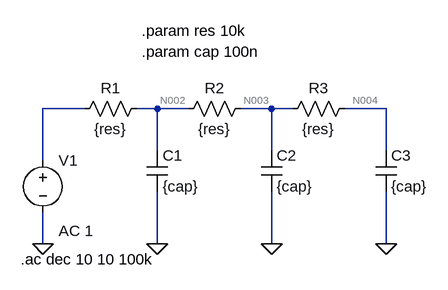
[diagram p0: schematic Draft1.asc]
Draft1.asc, the LTspice schematic file:
Version 4
SHEET 1 880 680
WIRE 80 64 16 64
WIRE 192 64 160 64
WIRE 240 64 192 64
WIRE 368 64 320 64
WIRE 400 64 368 64
WIRE 544 64 480 64
WIRE 192 128 192 64
WIRE 368 128 368 64
WIRE 544 128 544 64
WIRE 16 144 16 64
WIRE 16 272 16 224
WIRE 192 272 192 192
WIRE 368 272 368 192
WIRE 544 272 544 192
FLAG 16 272 0
FLAG 192 272 0
FLAG 368 272 0
FLAG 544 272 0
SYMBOL voltage 16 128 R0
WINDOW 123 24 124 Left 2
WINDOW 39 0 0 Left 0
SYMATTR InstName V1
SYMATTR Value ""
SYMATTR Value2 AC 1
SYMBOL res 176 48 R90
WINDOW 0 0 56 VBottom 2
WINDOW 3 32 56 VTop 2
SYMATTR InstName R1
SYMATTR Value {res}
SYMBOL res 336 48 R90
WINDOW 0 0 56 VBottom 2
WINDOW 3 32 56 VTop 2
SYMATTR InstName R2
SYMATTR Value {res}
SYMBOL res 496 48 R90
WINDOW 0 0 56 VBottom 2
WINDOW 3 32 56 VTop 2
SYMATTR InstName R3
SYMATTR Value {res}
SYMBOL cap 176 128 R0
SYMATTR InstName C1
SYMATTR Value {cap}
SYMBOL cap 352 128 R0
SYMATTR InstName C2
SYMATTR Value {cap}
SYMBOL cap 528 128 R0
SYMATTR InstName C3
SYMATTR Value {cap}
TEXT 168 -56 Left 2 !.param res 10k
TEXT 168 -24 Left 2 !.param cap 100n
TEXT -18 296 Left 2 !.ac dec 10 10 100k

The netlist it stands for:
* Draft1.asc
V1 N001 0 AC 1
R1 N002 N001 {res}
R2 N003 N002 {res}
R3 N004 N003 {res}
C1 N002 0 {cap}
C2 N003 0 {cap}
C3 N004 0 {cap}
.param res 10k
.param cap 100n
.ac dec 10 10 100k
.backanno
.end

* Results of the author's LTspice run, read from the files saved beside the schematic
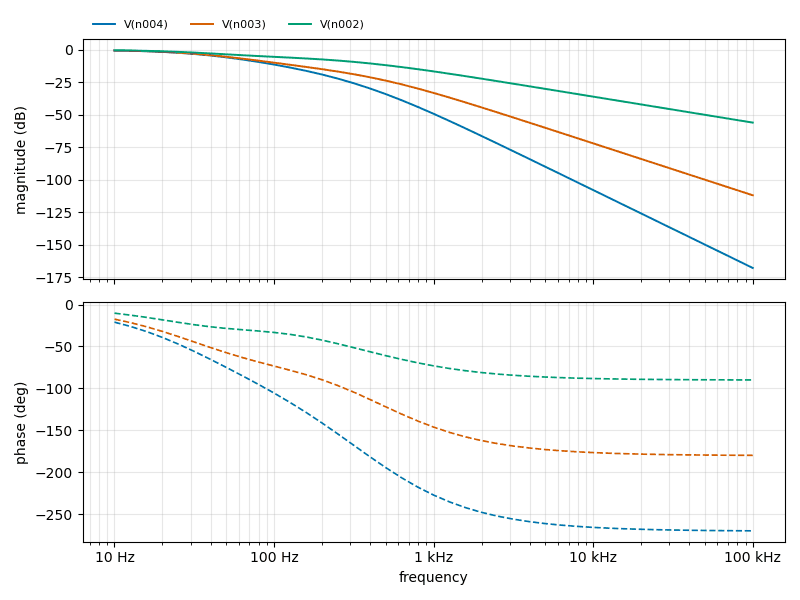
[diagram p1: AC Analysis of Draft1.asc, plotted from the saved traces]
* AC Analysis, 1 run:
*   V(n004): -0.43 dB at 10 Hz, -167.89 dB at 100 kHz, peak -0.43 dB at 10 Hz, 3 dB below the peak at 33.71 Hz
*   V(n003): -0.41 dB at 10 Hz, -111.93 dB at 100 kHz, peak -0.41 dB at 10 Hz, 3 dB below the peak at 35.03 Hz
*   V(n002): -0.31 dB at 10 Hz, -55.96 dB at 100 kHz, peak -0.31 dB at 10 Hz, 3 dB below the peak at 49.14 Hz